# EAGLE board BCN3D electronics (EAGLE 7.5.0), part 1 of 2
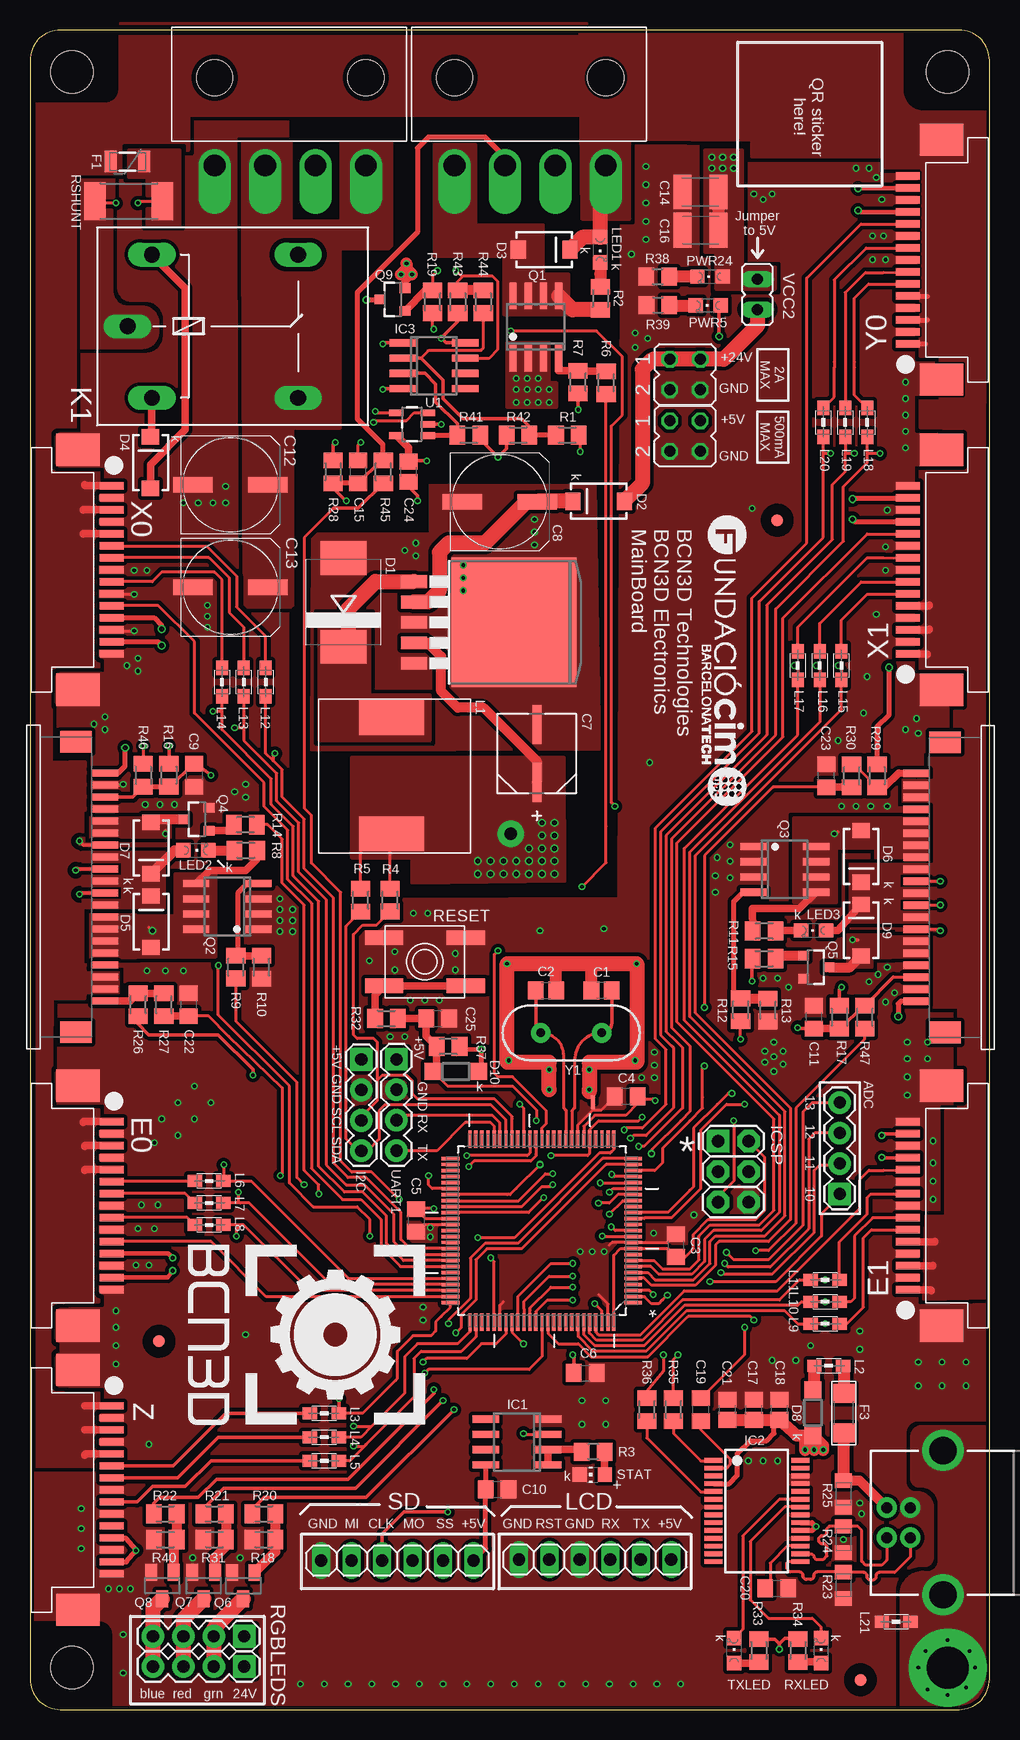
[diagram p2: board, top side]
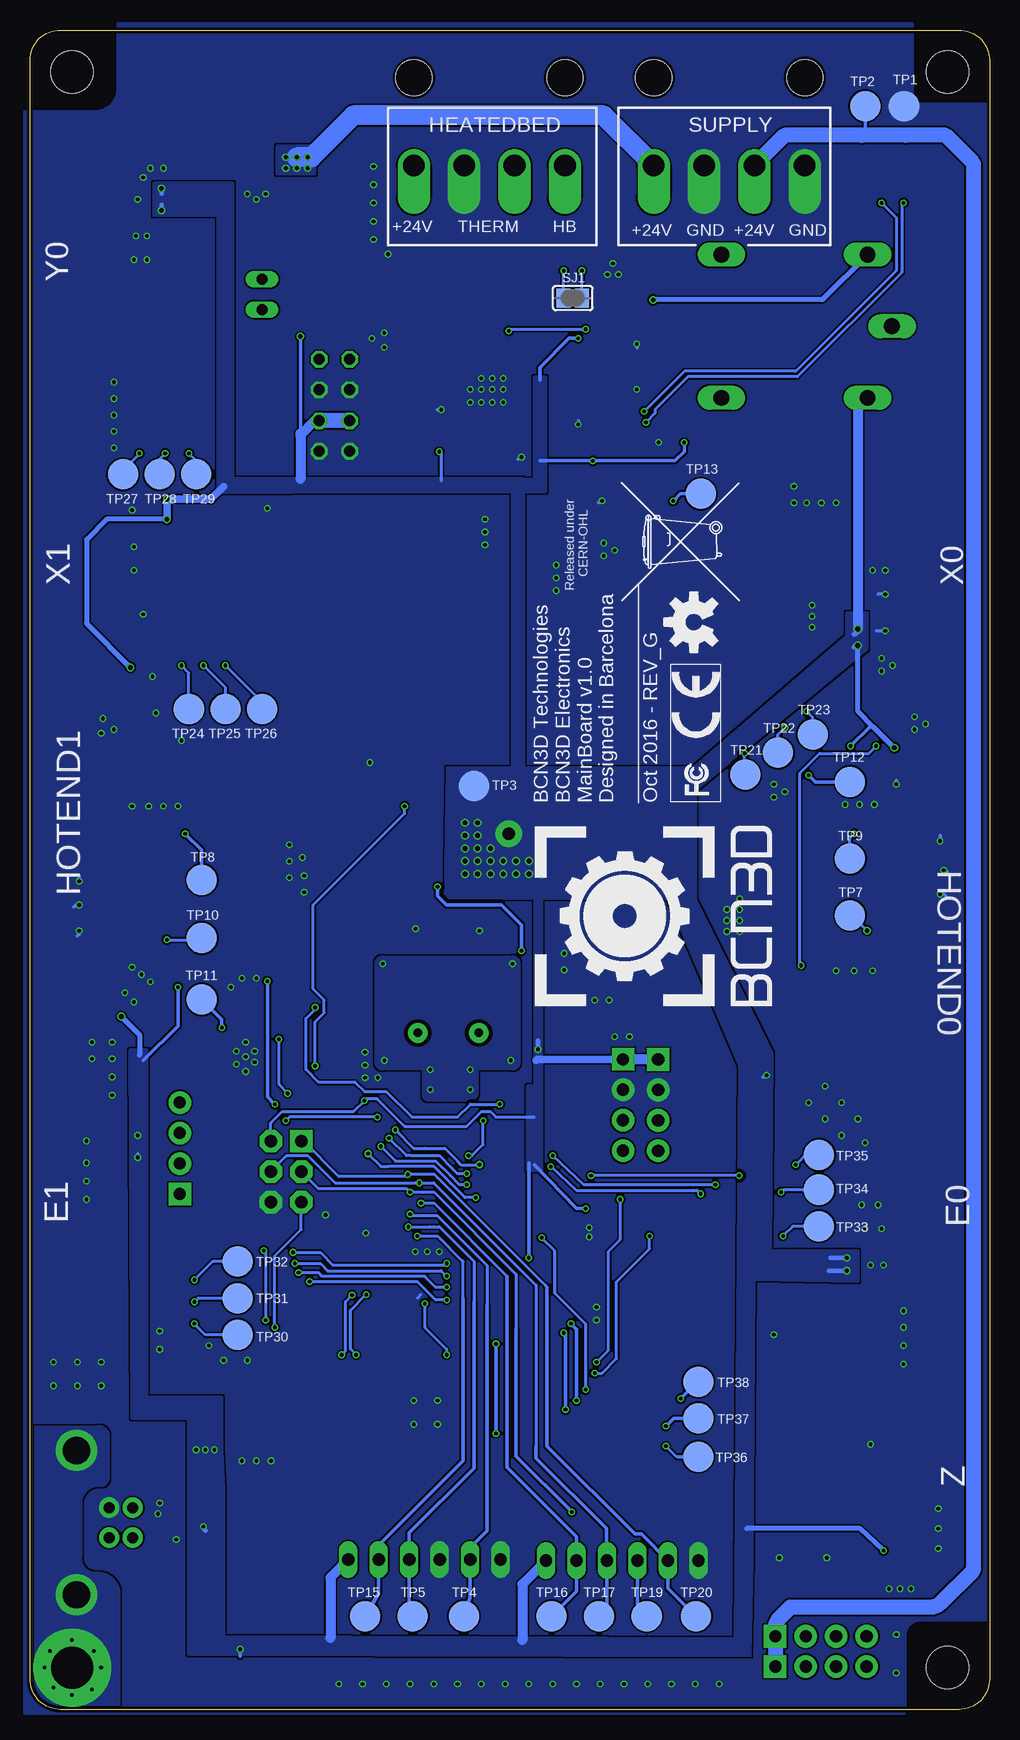
[diagram p3: board, bottom side, seen from below]

Size 80 x 140 mm. Coordinates in mm from the lower left corner, seen from the top.
Outline: 0,137.46 0,2.54 arc90 2.54,0 77.46,0 arc90 80,2.54 80,137.46 arc90 77.46,140 2.54,140 arc90 0,137.46
Copper layers (1*16): Top 0.018mm / dielectric 1.55mm / Bottom 0.018mm
Design rules "eC_2Layer_PClass6_BaseCopperO18_eCDefault": minimum track width 0.15mm, minimum drill 0.35mm, track to track 0.15mm, track to pad 0.15mm, pad to pad 0.15mm, via to via 0.15mm, smd to smd 0mil, copper to edge 0.25mm, drill to drill 0.35mm, minimum pad ring 0.175mm, minimum via ring 0.125mm, stop-mask expansion 0mil, vias tented up to drill 0.45mm, thermal gap 0.2mm
Holes 3.5 mm at 3.5,3.5 76.5,136.5 3.5,136.5

## Footprints (pad centres in the part's own frame; a part is rotated, then mirrored left to right if it is on the bottom)
JP2Q = drill 0.914 octagon: 1 -1.27,-1.27; 2 1.27,-1.27; 3 -1.27,1.27; 4 1.27,1.27
1X04 = drill 1.016 pad 1.88 square: 1 0,0 | drill 1.016 pad 1.88: 2 2.54,0; 3 5.08,0; 4 7.62,0
QFP50P1600X1600X120-100N = smd 1.473 x 0.279: 1 -7.62,5.994; 2 -7.62,5.512; 3 -7.62,5.004; 4 -7.62,4.496; 5 -7.62,3.988; 6 -7.62,3.505; 7 -7.62,2.997; 8 -7.62,2.489; 9 -7.62,2.007; 10 -7.62,1.499; 11 -7.62,0.991; 12 -7.62,0.508; 13 -7.62,0; 14 -7.62,-0.508; 15 -7.62,-0.991; 16 -7.62,-1.499; 17 -7.62,-2.007; 18 -7.62,-2.489; 19 -7.62,-2.997; 20 -7.62,-3.505; 21 -7.62,-3.988; 22 -7.62,-4.496; 23 -7.62,-5.004; 24 -7.62,-5.512; 25 -7.62,-5.994; 51 7.62,-5.994; 52 7.62,-5.512; 53 7.62,-5.004; 54 7.62,-4.496; 55 7.62,-3.988; 56 7.62,-3.505; 57 7.62,-2.997; 58 7.62,-2.489; 59 7.62,-2.007; 60 7.62,-1.499; 61 7.62,-0.991; 62 7.62,-0.508; 63 7.62,0; 64 7.62,0.508; 65 7.62,0.991; 66 7.62,1.499; 67 7.62,2.007; 68 7.62,2.489; 69 7.62,2.997; 70 7.62,3.505; 71 7.62,3.988; 72 7.62,4.496; 73 7.62,5.004; 74 7.62,5.512; 75 7.62,5.994 | smd 0.279 x 1.473: 26 -5.994,-7.62; 27 -5.512,-7.62; 28 -5.004,-7.62; 29 -4.496,-7.62; 30 -3.988,-7.62; 31 -3.505,-7.62; 32 -2.997,-7.62; 33 -2.489,-7.62; 34 -2.007,-7.62; 35 -1.499,-7.62; 36 -0.991,-7.62; 37 -0.508,-7.62; 38 0,-7.62; 39 0.508,-7.62; 40 0.991,-7.62; 41 1.499,-7.62; 42 2.007,-7.62; 43 2.489,-7.62; 44 2.997,-7.62; 45 3.505,-7.62; 46 3.988,-7.62; 47 4.496,-7.62; 48 5.004,-7.62; 49 5.512,-7.62; 50 5.994,-7.62; 76 5.994,7.62; 77 5.512,7.62; 78 5.004,7.62; 79 4.496,7.62; 80 3.988,7.62; 81 3.505,7.62; 82 2.997,7.62; 83 2.489,7.62; 84 2.007,7.62; 85 1.499,7.62; 86 0.991,7.62; 87 0.508,7.62; 88 0,7.62; 89 -0.508,7.62; 90 -0.991,7.62; 91 -1.499,7.62; 92 -2.007,7.62; 93 -2.489,7.62; 94 -2.997,7.62; 95 -3.505,7.62; 96 -3.988,7.62; 97 -4.496,7.62; 98 -5.004,7.62; 99 -5.512,7.62; 100 -5.994,7.62
C0805 = smd 1.3 x 1.5: 1 -0.85,0; 2 0.85,0
C0805' = smd 1.3 x 1.5: 1 -0.95,0; 2 0.95,0
CAPAE660X610N = smd 3.251 x 0.762: 1 -2.413,0; 2 2.413,0
UD-8X10_NICHICON = smd 3.3 x 1.3: + 3.125,0; - -3.125,0
C1210K = smd 1.5 x 2.9: 1 -1.5,0; 2 1.5,0
SMC = smd 2.8 x 3.8: A 3.7,0; C -3.7,0
SMA-DIODE = smd 1.27 x 1.47: A -2.15,0; C 2.15,0
SOD123 = smd 1.4 x 1.4: A 1.9,0; C -1.9,0
TE_FFC_CON1MM = smd 0.61 x 2: 1 -7.01,2.8; 2 -6.01,2.8; 3 -5.01,2.8; 4 -4.01,2.8; 5 -3.01,2.8; 6 -2.01,2.8; 7 -1.01,2.8; 8 -0.01,2.8; 9 0.99,2.8; 10 1.99,2.8; 11 2.99,2.8; 12 3.99,2.8; 13 4.99,2.8; 14 5.99,2.8; 15 6.99,2.8 | smd 2.68 x 3.6: GND@1 -10,0; GND@2 10,0
PTC-1206 = smd 1 x 1.8: 1 -1.4,0; 2 1.4,0
MICROBUILDER_1206_PTC = smd 1.6 x 1.8: 1 -1.654,0; 2 1.654,0
FIDUCIAL_1MM = smd 1 x 1: 1 0,0
MOLEX_MINIFIT-JR = drill 1.8 offset: 1 -6.1,3.7; 2 -1.9,3.7; 3 2.3,3.7; 4 6.5,3.7 | hole 3: -6.1,-3.6; 6.5,-3.6
68612014422 = smd 0.6 x 2.2: 1 -15.77,1.1; 2 -14.77,1.1; 3 -13.77,1.1; 4 -12.77,1.1; 5 -11.77,1.1; 6 -10.77,1.1; 7 -9.77,1.1; 8 -8.77,1.1; 9 -7.77,1.1; 10 -6.77,1.1; 11 -5.77,1.1; 12 -4.77,1.1; 13 -3.77,1.1; 14 -2.77,1.1; 15 -1.77,1.1; 16 -0.77,1.1; 17 0.23,1.1; 18 1.23,1.1; 19 2.23,1.1; 20 3.23,1.1 | smd 1.8 x 2.6: Z1 -18.37,-1.3; Z2 5.83,-1.3
SO08 = smd 0.6 x 2.2: 1 -1.905,-2.6; 2 -0.635,-2.6; 3 0.635,-2.6; 4 1.905,-2.6; 5 1.905,2.6; 6 0.635,2.6; 7 -0.635,2.6; 8 -1.905,2.6
SSOP28 = smd 0.4 x 1.5: 1 -4.225,-3.625; 2 -3.575,-3.625; 3 -2.925,-3.625; 4 -2.275,-3.625; 5 -1.625,-3.625; 6 -0.975,-3.625; 7 -0.325,-3.625; 8 0.325,-3.625; 9 0.975,-3.625; 10 1.625,-3.625; 11 2.275,-3.625; 12 2.925,-3.625; 13 3.575,-3.625; 14 4.225,-3.625; 15 4.225,3.625; 16 3.575,3.625; 17 2.925,3.625; 18 2.275,3.625; 19 1.625,3.625; 20 0.975,3.625; 21 0.325,3.625; 22 -0.325,3.625; 23 -0.975,3.625; 24 -1.625,3.625; 25 -2.275,3.625; 26 -2.925,3.625; 27 -3.575,3.625; 28 -4.225,3.625
2X3-NS = drill 1.016 pad 1.88 square: 1 -2.54,-1.27 | drill 1.016 pad 1.88 octagon: 2 -2.54,1.27; 3 0,-1.27; 4 0,1.27; 5 2.54,-1.27; 6 2.54,1.27
G5LE = drill 1.321 long: 1 -7.493,-5.969; 2 -7.493,5.969; O 4.699,5.969; P -9.525,0; S 4.699,-5.969
SSR1260 = smd 2.9 x 5.4: A -4.85,0; B 4.85,0
0805 = smd 1.2 x 1: 1 -1.2,0; 2 1.2,0
1X06 = drill 1.016 long: 1 -6.35,0; 2 -3.81,0; 3 -1.27,0; 4 1.27,0; 5 3.81,0; 6 6.35,0
CHIPLED_0805 = smd 1.2 x 1.2: A 0,-1.05; C 0,1.05
TO263-5 = smd 1.067 x 2.159: 1 -3.404,-5.791; 2 -1.702,-5.791; 3 0,-5.791; 4 1.702,-5.791; 5 3.404,-5.791 | smd 10.8 x 10.41: 6 0,2.54
SOIC8 = smd 0.6 x 2.2: 1 -1.905,-2.6; 2 -0.635,-2.6; 3 0.635,-2.6; 4 1.905,-2.6; 5 1.905,2.6; 6 0.635,2.6; 7 -0.635,2.6; 8 -1.905,2.6
SOT23-3 = smd 0.8 x 0.9: 1 -0.95,-1; 2 0.95,-1; 3 0,1.1
SOT23 = smd 1 x 1.4: 1 -0.95,-1.1; 2 0.95,-1.1; 3 0,1.1
M0805 = smd 1.3 x 1.6: 1 -0.95,0; 2 0.95,0
R0805 = smd 1.3 x 1.5: 1 -0.95,0; 2 0.95,0
CT/CN0805 = smd 1.2 x 1.4: 1 -1.1,0; 2 1.1,0
EVQ-Q2 = smd 3.2 x 1.2: A -3.4,-2; A' 3.4,-2; B -3.4,2; B' 3.4,2
R2512 = smd 1.8 x 3.2: 1 -2.8,0; 2 2.8,0
SHORT_TOP-50 = smd 0.61 x 0.305: 1 0.381,0; 2 -0.127,0
SJ = smd 1.168 x 1.6: 1 -0.762,0; 2 0.762,0
CHIP-LED0805 = smd 1.2 x 1.2: A 0,-1.05; C 0,1.05
B2,54 = smd 2.54 x 2.54: TP 0,0
SOT23-5 = smd 0.55 x 1.2: 1 -0.95,-1.3; 2 0,-1.3; 3 0.95,-1.3; 4 0.95,1.3; 5 -0.95,1.3
USB-B-PTH = drill 0.914 pad 1.676: D+ 0,1.25; D- 1.981,1.25; GND 0,-1.25; VBUS 1.981,-1.25 | drill 2.286: S1 -2.718,-6.02; S2 -2.718,6.02
JP1 = drill 0.914 long: 1 0,-1.27; 2 0,1.27
HC49US = drill 0.7 pad 1.651: 1 -2.54,0; 2 2.54,0

## Placement (x,y rotation side)
+5V  [JP2Q]  54.62,111.29 270 top
+24V  [JP2Q]  54.62,106.15 270 top
ADC  [1X04]  67.51,42.98 90 top
ATMEGA2560  ATMEGA2560-16AU  [QFP50P1600X1600X120-100N]  42.68,39.92 180 top
C1  22p  [C0805]  47.66,59.94 180 top
C2  22p  [C0805]  43.02,59.94 0 top
C3  100n  [C0805']  53.87,38.68 90 top
C4  100n  [C0805']  49.71,51.1 180 top
C5  100n  [C0805']  32.18,40.77 270 top
C6  100n  [C0805']  46.29,28.05 0 top
C7  150UF  [CAPAE660X610N]  42.26,79.69 90 top
C8  220u  [UD-8X10_NICHICON]  39.15,100.68 0 top
C9  10u  [C0805']  13.7,77.87 270 top
C10  100n  [C0805']  38.94,18.35 0 top
C11  10u  [C0805']  65.37,57.71 90 top
C12  100u  [UD-8X10_NICHICON]  16.72,102.08 0 top
C13  100u  [UD-8X10_NICHICON]  16.72,93.54 0 top
C14  10u  [C1210K]  55.9,126.51 180 top
C15  10u  [C0805']  27.37,103.17 90 top
C16  10u  [C1210K]  55.9,123.31 180 top
C17  4.7u  [C0805]  60.35,24.99 90 top
C18  10n  [C0805]  62.48,24.99 90 top
C19  100n  [C0805']  55.93,24.99 90 top
C20  100n  [C0805']  62.26,10.11 0 top
C21  100n  [C0805]  58.15,24.99 90 top
C22  0.1u  [C0805']  13.25,58.74 90 top
C23  0.1u  [C0805']  66.39,77.83 90 top
C24  100n  [C0805]  31.55,103.17 270 top
C25  10n  [C0805']  33.99,57.61 0 top
D1  [SMC]  26.15,92.28 90 top
D2  MBRA140  [SMA-DIODE]  47.42,100.72 180 top
D3  MBRA140  [SMA-DIODE]  42.87,121.69 0 top
D4  MBRA140  [SMA-DIODE]  10.05,103.93 90 top
D5  MBRA140  [SMA-DIODE]  10.1,65.66 90 top
D6  MBRA140  [SMA-DIODE]  69.29,71.11 270 top
D7  MBRA140  [SMA-DIODE]  10.1,71.82 270 top
D8  MBR0520LT  [SOD123]  65.28,24.75 90 top
D9  MBRA140  [SMA-DIODE]  69.29,64.96 90 top
D10  MBR0520LT  [SOD123]  35.51,53.19 180 top
E0  FFC_15V_90G_1MM  [TE_FFC_CON1MM]  4,42 270 top
E1  FFC_15V_90G_1MM  [TE_FFC_CON1MM]  76,42 90 top
F1  IN_PTC  [PTC-1206]  8.13,129.03 180 top
F3  [MICROBUILDER_1206_PTC]  67.86,24.71 90 top
FID1  FIDUCIAL  [FIDUCIAL_1MM]  69.24,2.48 0 top
FID2  FIDUCIAL  [FIDUCIAL_1MM]  10.76,30.7 0 top
FID3  FIDUCIAL  [FIDUCIAL_1MM]  62.31,99.13 0 top
HEATEDBED  PC4WAY  [MOLEX_MINIFIT-JR]  41.9,132.42 180 top
HOTEND0  68612014422  [68612014422]  5.14,62.3 270 top
HOTEND1  68612014422  [68612014422]  75,74.81 90 top
I2C  [1X04]  27.63,54.19 270 top
IC1  LM358D  [SO08]  40.6,22.3 90 top
IC2  FT232RL  [SSOP28]  60.6,16.55 270 top
IC3  LM311D  [SO08]  33.68,112.01 270 top
ICSP  AVR_SPI_PRG_6NS  [2X3-NS]  58.65,44.84 270 top
K1  G5L  [G5LE]  17.66,115.3 0 top
L1  100u  [SSR1260]  30.15,77.85 270 top
L2  [0805]  66.6,28.65 180 top
L3  [0805]  24.54,24.69 0 top
L4  [0805]  24.54,22.71 0 top
L5  [0805]  24.54,20.73 0 top
L6  [0805]  14.94,44.04 180 top
L7  [0805]  14.94,42.21 180 top
L8  [0805]  14.94,40.39 180 top
L9  [0805]  66.29,32.16 180 top
L10  [0805]  66.29,33.99 180 top
L11  [0805]  66.29,35.81 180 top
L12  [0805]  19.66,85.65 270 top
L13  [0805]  17.83,85.65 270 top
L14  [0805]  16,85.65 270 top
L15  [0805]  67.67,87.02 270 top
L16  [0805]  65.84,87.02 270 top
L17  [0805]  64.01,87.02 270 top
L18  [0805]  69.8,107.29 270 top
L19  [0805]  67.97,107.29 270 top
L20  [0805]  66.14,107.29 270 top
L21  [0805]  72.22,7.32 0 top
LCD  [1X06]  47.11,12.5 180 top
LED1  Blue  [CHIPLED_0805]  47.54,121.68 180 top
LED2  Blue  [CHIPLED_0805]  13.83,71.62 270 top
LED3  Blue  [CHIPLED_0805]  65.34,64.94 90 top
LEDS1  [1X04]  17.86,6.11 180 top
LM2595  [TO263-5]  37.8,90.62 270 top
LOGO1  OSHW-LOGOM  [OSHW-LOGO-M]  24.65,90.64 90 bottom
PWR5  Blue  [CHIPLED_0805]  56.54,117.04 90 top
PWR24  Blue  [CHIPLED_0805]  56.69,119.44 90 top
Q1  MOSFET-NSOIC8  [SOIC8]  42.17,115.24 0 top
Q2  MOSFET-NSOIC8  [SOIC8]  16.46,66.94 90 top
Q3  MOSFET-NSOIC8  [SOIC8]  62.93,70.03 270 top
Q4  MMBT2222A  [SOT23-3]  13.94,74.21 90 top
Q5  MMBT2222A  [SOT23-3]  65.49,61.87 270 top
Q6  [SOT23]  17.79,10.32 180 top
Q7  [SOT23]  14.48,10.33 180 top
Q8  [SOT23]  11.03,10.33 180 top
Q9  MMBT2222A  [SOT23-3]  30.26,117.53 90 top
R1  10K  [M0805]  44.81,106.22 180 top
R2  5.6k  [M0805]  47.56,117.63 90 top
R3  1K  [R0805]  46.96,21.5 180 top
R4  4.7k  [M0805]  30.02,67.47 270 top
R5  4.7k  [M0805]  27.57,67.46 270 top
R6  1K  [M0805]  48.04,110.6 270 top
R7  10K  [M0805]  45.69,110.65 270 top
R8  5.6k  [M0805]  17.99,71.62 180 top
R9  1K  [M0805]  17.17,61.89 270 top
R10  10K  [M0805]  19.31,61.87 270 top
R11  5.6k  [M0805]  61.21,64.9 0 top
R12  1K  [M0805]  59.25,58.32 270 top
R13  10K  [M0805]  61.53,58.31 270 top
R14  1K  [M0805]  17.96,73.75 0 top
R15  1K  [M0805]  61.21,62.59 180 top
R16  4.7K  [M0805]  11.58,77.89 90 top
R17  4.7K  [M0805]  67.48,57.71 90 top
R18  10K  [M0805]  19.51,14.17 180 top
R19  1K  [M0805]  33.55,117.35 270 top
R20  1K  [M0805]  19.51,16.31 180 top
R21  1K  [M0805]  15.39,16.31 180 top
R22  1K  [M0805]  11.28,16.31 180 top
R23  VARISTORCN0805  [CT/CN0805]  67.82,10.36 270 top
R24  VARISTORCN0805  [CT/CN0805]  67.82,14.17 270 top
R25  VARISTORCN0805  [CT/CN0805]  67.82,17.98 270 top
R26  4.7K  [M0805]  9.01,58.76 270 top
R27  1K  [M0805]  11.16,58.76 270 top
R28  4.7K  [M0805]  25.27,103.17 90 top
R29  4.7K  [M0805]  70.62,77.83 90 top
R30  1K  [M0805]  68.5,77.83 270 top
R31  10K  [M0805]  15.39,14.17 180 top
R32  330  [M0805]  29.72,57.61 180 top
R33  1K  [M0805]  60.76,4.92 90 top
R34  1K  [M0805]  64.02,4.92 90 top
R35  1K  [M0805]  53.65,24.99 270 top
R36  1K  [M0805]  51.44,24.99 270 top
R37  10k  [M0805]  34.86,55.27 0 top
R38  5.6K  [R0805]  52.33,119.43 0 top
R39  1K  [R0805]  52.35,117.06 0 top
R40  10K  [M0805]  11.28,14.17 180 top
R41  20K  [M0805]  36.58,106.22 180 top
R42  10K  [M0805]  40.69,106.22 180 top
R43  1K  [M0805]  35.66,117.35 90 top
R44  100K  [M0805]  37.8,117.35 90 top
R45  1K  [M0805]  29.46,103.17 270 top
R46  1K  [M0805]  9.45,77.88 90 top
R47  1K  [M0805]  69.6,57.71 270 top
RESET  SPST  [EVQ-Q2]  32.92,62.33 180 top
RGBLEDS  [1X04]  17.86,3.58 180 top
RSHUNT  10m  [R2512]  8.23,125.73 0 top
RXLED  green  [CHIPLED_0805]  65.96,4.91 0 top
SD  [1X06]  30.62,12.41 0 top
SH1  SHORTT5  [SHORT_TOP-50]  46.94,50.75 270 top
SJ1  [SJ]  34.75,117.65 0 bottom
STAT  Orange  [CHIP-LED0805]  46.88,19.57 90 top
SUPPLY  PC4WAY  [MOLEX_MINIFIT-JR]  21.9,132.42 180 top
TP1  TPB2,54  [B2,54]  7.12,133.65 0 bottom
TP2  TPB2,54  [B2,54]  10.36,133.65 0 bottom
TP3  TPB2,54  [B2,54]  42.98,76.96 270 bottom
TP4  TPB2,54  [B2,54]  43.82,7.77 90 bottom
TP5  TPB2,54  [B2,54]  48.09,7.77 90 bottom
TP7  TPB2,54  [B2,54]  11.63,66.2 270 bottom
TP8  TPB2,54  [B2,54]  65.68,69.15 270 bottom
TP9  TPB2,54  [B2,54]  11.63,70.93 270 bottom
TP10  TPB2,54  [B2,54]  65.68,64.31 270 bottom
TP11  TPB2,54  [B2,54]  65.68,59.19 270 bottom
TP12  TPB2,54  [B2,54]  11.63,77.33 270 bottom
TP13  TPB2,54  [B2,54]  24.08,101.35 0 bottom
TP15  TPB2,54  [B2,54]  52.05,7.77 90 bottom
TP16  TPB2,54  [B2,54]  36.51,7.77 90 bottom
TP17  TPB2,54  [B2,54]  32.55,7.77 90 bottom
TP19  TPB2,54  [B2,54]  28.58,7.77 90 bottom
TP20  TPB2,54  [B2,54]  24.47,7.77 90 bottom
TP21  TPB2,54  [B2,54]  20.37,77.93 0 bottom
TP22  TPB2,54  [B2,54]  17.63,79.76 0 bottom
TP23  TPB2,54  [B2,54]  14.73,81.28 0 bottom
TP24  TPB2,54  [B2,54]  66.75,83.41 180 bottom
TP25  TPB2,54  [B2,54]  63.7,83.41 180 bottom
TP26  TPB2,54  [B2,54]  60.66,83.41 180 bottom
TP27  TPB2,54  [B2,54]  72.24,102.97 180 bottom
TP28  TPB2,54  [B2,54]  69.19,102.97 180 bottom
TP29  TPB2,54  [B2,54]  66.14,102.97 180 bottom
TP30  TPB2,54  [B2,54]  62.69,31.24 270 bottom
TP31  TPB2,54  [B2,54]  62.69,34.29 270 bottom
TP32  TPB2,54  [B2,54]  62.69,37.34 270 bottom
TP33  TPB2,54  [B2,54]  14.22,40.28 270 bottom
TP34  TPB2,54  [B2,54]  14.22,43.33 270 bottom
TP35  TPB2,54  [B2,54]  14.22,46.23 270 bottom
TP36  TPB2,54  [B2,54]  24.28,21.08 270 bottom
TP37  TPB2,54  [B2,54]  24.28,24.28 270 bottom
TP38  TPB2,54  [B2,54]  24.28,27.33 270 bottom
TXLED  green  [CHIPLED_0805]  58.7,4.91 0 top
U1  INA169  [SOT23-5]  31.85,107.14 90 top
U$2  [TONNE_10.00]  23.77,97.23 90 bottom
U$3  [FCC_10X4.175MM]  22.4,75.59 90 bottom
U$4  [CE-4MM]  22.45,80.92 90 bottom
U$5  [BCN3D_LOGO]  13.18,38.71 270 top
U$6  USB+SHIELD  [USB-B-PTH]  73.4,15.58 180 top
U$8  [BCN3D_LOGO]  18.14,58.67 90 bottom
U$9  [FCIM_LOGO]  52.36,101.35 270 top
UART1  [1X04]  30.56,54.2 270 top
VCC2  [JP1]  60.66,117.96 180 top
X0  FFC_15V_90G_1MM  [TE_FFC_CON1MM]  4,95 270 top
X1  FFC_15V_90G_1MM  [TE_FFC_CON1MM]  76,95 90 top
Y0  FFC_15V_90G_1MM  [TE_FFC_CON1MM]  76,120.84 90 top
Y1  [HC49US]  45.13,56.4 0 top
Z  FFC_15V_90G_1MM  [TE_FFC_CON1MM]  4,18.3 270 top